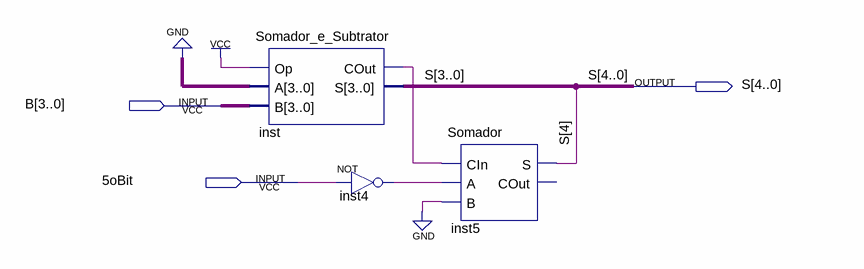
[diagram p0: schematic sheet]
// Quartus schematic ComplementoDeDois.bdf as structural Verilog: 3 symbols, 3 pins
module ComplementoDeDois (
  input  [3:0] B,
  input  \5oBit ,
  output [4:0] S
);

  wire inst4_out, inst_cout;

  Somador_e_Subtrator inst (.Op(1'b1), .A(4'b0000), .B(B), .COut(inst_cout), .S(S[3:0]));
  not inst4 (inst4_out, \5oBit );
  Somador inst5 (.CIn(inst_cout), .A(inst4_out), .B(1'b0), .S(S[4]));  // open: COut
endmodule
